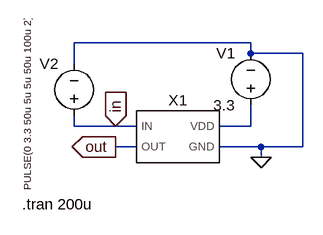
[diagram p0: schematic inverter_test.asc]
inverter_test.asc, the LTspice schematic file:
Version 4.1
SHEET 1 880 680
WIRE 304 16 32 16
WIRE 304 32 304 16
WIRE 384 32 304 32
WIRE 32 48 32 16
WIRE 32 144 32 128
WIRE 96 144 32 144
WIRE 128 144 96 144
WIRE 304 144 304 112
WIRE 304 144 256 144
WIRE 128 176 96 176
WIRE 320 176 256 176
WIRE 384 176 384 32
WIRE 384 176 320 176
WIRE 320 192 320 176
FLAG 320 192 0
FLAG 96 144 in
IOPIN 96 144 In
FLAG 96 176 out
IOPIN 96 176 Out
SYMBOL inverter 192 160 R0
SYMATTR InstName X1
SYMATTR Value ""
SYMBOL voltage 304 128 R180
WINDOW 0 24 96 Left 2
WINDOW 3 24 16 Left 2
WINDOW 123 0 0 Left 0
WINDOW 39 0 0 Left 0
SYMATTR InstName V1
SYMATTR Value 3.3
SYMBOL voltage 32 144 R180
WINDOW 0 24 96 Left 2
WINDOW 3 72 162 VLeft 1
WINDOW 123 0 0 Left 0
WINDOW 39 0 0 Left 0
SYMATTR InstName V2
SYMATTR Value PULSE(0 3.3 50u 5u 5u 50u 100u 2)
TEXT -48 264 Left 2 !.tran 200u

The netlist it stands for:
* inverter_test.asc
X§X1 in out N001 0 INVERTER  ; pins IN OUT VDD GND
V1 N001 0 3.3
V2 in 0 PULSE(0 3.3 50u 5u 5u 50u 100u 2)
.tran 200u
.lib yap_cells.lib
.backanno
.end